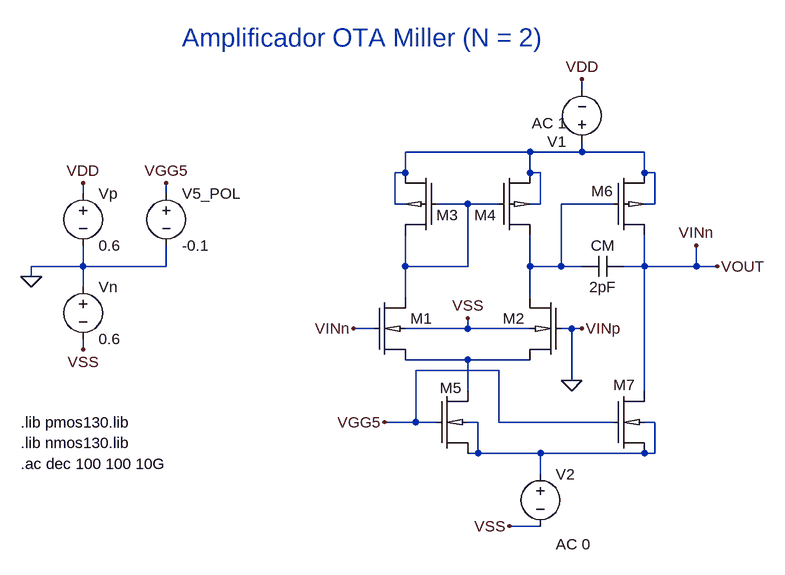
[diagram p0: schematic PSRR.asc]
PSRR.asc, the LTspice schematic file:
Version 4.1
SHEET 1 1248 680
WIRE 768 -368 768 -384
WIRE 688 -272 496 -272
WIRE 768 -272 768 -288
WIRE 768 -272 688 -272
WIRE 864 -272 768 -272
WIRE 496 -240 496 -272
WIRE 496 -240 480 -240
WIRE 688 -240 688 -272
WIRE 704 -240 688 -240
WIRE 864 -240 864 -272
WIRE 880 -240 864 -240
WIRE 0 -208 0 -224
WIRE 128 -208 128 -224
WIRE 480 -192 480 -240
WIRE 496 -192 480 -192
WIRE 592 -192 544 -192
WIRE 640 -192 592 -192
WIRE 704 -192 704 -240
WIRE 704 -192 688 -192
WIRE 816 -192 736 -192
WIRE 880 -192 880 -240
WIRE 880 -192 864 -192
WIRE 0 -96 0 -128
WIRE 0 -96 -80 -96
WIRE 128 -96 128 -128
WIRE 128 -96 0 -96
WIRE 496 -96 496 -144
WIRE 592 -96 592 -192
WIRE 592 -96 496 -96
WIRE 688 -96 688 -144
WIRE 736 -96 736 -192
WIRE 736 -96 688 -96
WIRE 768 -96 736 -96
WIRE 864 -96 864 -144
WIRE 864 -96 832 -96
WIRE 944 -96 944 -128
WIRE 944 -96 864 -96
WIRE 976 -96 944 -96
WIRE -80 -80 -80 -96
WIRE 0 -64 0 -96
WIRE 496 -48 496 -96
WIRE 688 -48 688 -96
WIRE 448 0 416 0
WIRE 592 0 592 -16
WIRE 592 0 496 0
WIRE 688 0 592 0
WIRE 752 0 736 0
WIRE 768 0 752 0
WIRE 0 32 0 16
WIRE 592 48 496 48
WIRE 688 48 592 48
WIRE 640 64 512 64
WIRE 752 80 752 0
WIRE 592 96 592 48
WIRE 864 96 864 -96
WIRE 512 144 512 64
WIRE 512 144 464 144
WIRE 544 144 512 144
WIRE 608 144 592 144
WIRE 640 144 640 64
WIRE 816 144 640 144
WIRE 880 144 864 144
WIRE 608 192 608 144
WIRE 608 192 592 192
WIRE 704 192 608 192
WIRE 864 192 704 192
WIRE 880 192 880 144
WIRE 880 192 864 192
WIRE 704 224 704 192
WIRE 704 304 656 304
FLAG -80 -80 0
FLAG 0 32 VSS
FLAG 0 -224 VDD
FLAG 768 -384 VDD
FLAG 656 304 VSS
FLAG 976 -96 VOUT
FLAG 768 0 VINp
FLAG 416 0 VINn
FLAG 464 144 VGG5
FLAG 128 -224 VGG5
FLAG 592 -16 VSS
FLAG 752 80 0
FLAG 944 -128 VINn
SYMBOL voltage 0 -224 R0
WINDOW 123 0 0 Left 0
WINDOW 39 0 0 Left 0
SYMATTR InstName Vp
SYMATTR Value 0.6
SYMBOL voltage 0 -80 R0
WINDOW 123 0 0 Left 0
WINDOW 39 0 0 Left 0
SYMATTR InstName Vn
SYMATTR Value 0.6
SYMBOL nmos130 448 -48 R0
WINDOW 3 56 72 Invisible 2
SYMATTR InstName M1
SYMATTR SpiceLine width=10u length=2u
SYMBOL nmos130 736 -48 M0
WINDOW 3 56 72 Invisible 2
SYMATTR InstName M2
SYMATTR SpiceLine width=10u length=2u
SYMBOL pmos130 544 -144 R180
WINDOW 0 -34 31 Left 2
WINDOW 3 56 72 Invisible 2
SYMATTR InstName M3
SYMATTR SpiceLine width=20u length=2u
SYMBOL pmos130 640 -144 M180
WINDOW 0 -38 31 Left 2
WINDOW 3 56 72 Invisible 2
SYMATTR InstName M4
SYMATTR SpiceLine width=20u length=2u
SYMBOL nmos130 544 96 R0
WINDOW 0 5 -5 Left 2
WINDOW 3 56 72 Invisible 2
SYMATTR InstName M5
SYMATTR SpiceLine width=1u length=1u
SYMBOL pmos130 816 -144 M180
WINDOW 0 -34 68 Left 2
WINDOW 3 56 72 Invisible 2
SYMATTR InstName M6
SYMATTR SpiceLine width=80u length=500n
SYMBOL nmos130 816 96 R0
WINDOW 0 0 -9 Left 2
WINDOW 3 56 72 Invisible 2
SYMATTR InstName M7
SYMATTR SpiceLine width=40u length=20u
SYMBOL cap 832 -112 R90
WINDOW 0 0 32 VBottom 2
WINDOW 3 32 32 VTop 2
SYMATTR InstName CM
SYMATTR Value 2pF
SYMBOL voltage 128 -224 R0
WINDOW 123 0 0 Left 0
WINDOW 39 0 0 Left 0
SYMATTR InstName V5_POL
SYMATTR Value -0.1
SYMBOL voltage 768 -272 R180
WINDOW 123 24 44 Left 2
WINDOW 39 0 0 Left 0
SYMATTR Value2 AC 1
SYMATTR InstName V1
SYMATTR Value ""
SYMBOL voltage 704 208 R0
WINDOW 123 24 124 Left 2
WINDOW 39 0 0 Left 0
SYMATTR Value2 AC 0
SYMATTR InstName V2
SYMATTR Value ""
TEXT -96 144 Left 2 !.lib pmos130.lib
TEXT -96 176 Left 2 !.lib nmos130.lib
TEXT 152 -448 Left 4 ;Amplificador OTA Miller (N = 2)
TEXT -96 208 Left 2 !.ac dec 100 100 10G

The netlist it stands for:
* PSRR.asc
Vp VDD 0 0.6
Vn 0 VSS 0.6
X§M1 N002 VINn N004 VSS nmos130 width=10u length=2u  ; pins D G S B
X§M2 N003 0 N004 VSS nmos130 width=10u length=2u  ; pins D G S B
X§M3 N002 N002 N001 N001 pmos130 width=20u length=2u  ; pins D G S B
X§M4 N003 N002 N001 N001 pmos130 width=20u length=2u  ; pins D G S B
X§M5 N004 VGG5 N005 N005 nmos130 width=1u length=1u  ; pins D G S B
X§M6 VINn N003 N001 N001 pmos130 width=80u length=500n  ; pins D G S B
X§M7 VINn VGG5 N005 N005 nmos130 width=40u length=20u  ; pins D G S B
CM VINn N003 2pF
V5_POL VGG5 0 -0.1
V1 N001 VDD AC 1
V2 N005 VSS AC 0
.lib pmos130.lib
.lib nmos130.lib
* Amplificador OTA Miller (N = 2)
.ac dec 100 100 10G
.backanno
.end